# EAGLE schematic DataloggerE7 (EAGLE 9.3.1)

## Sheet 1 of 4
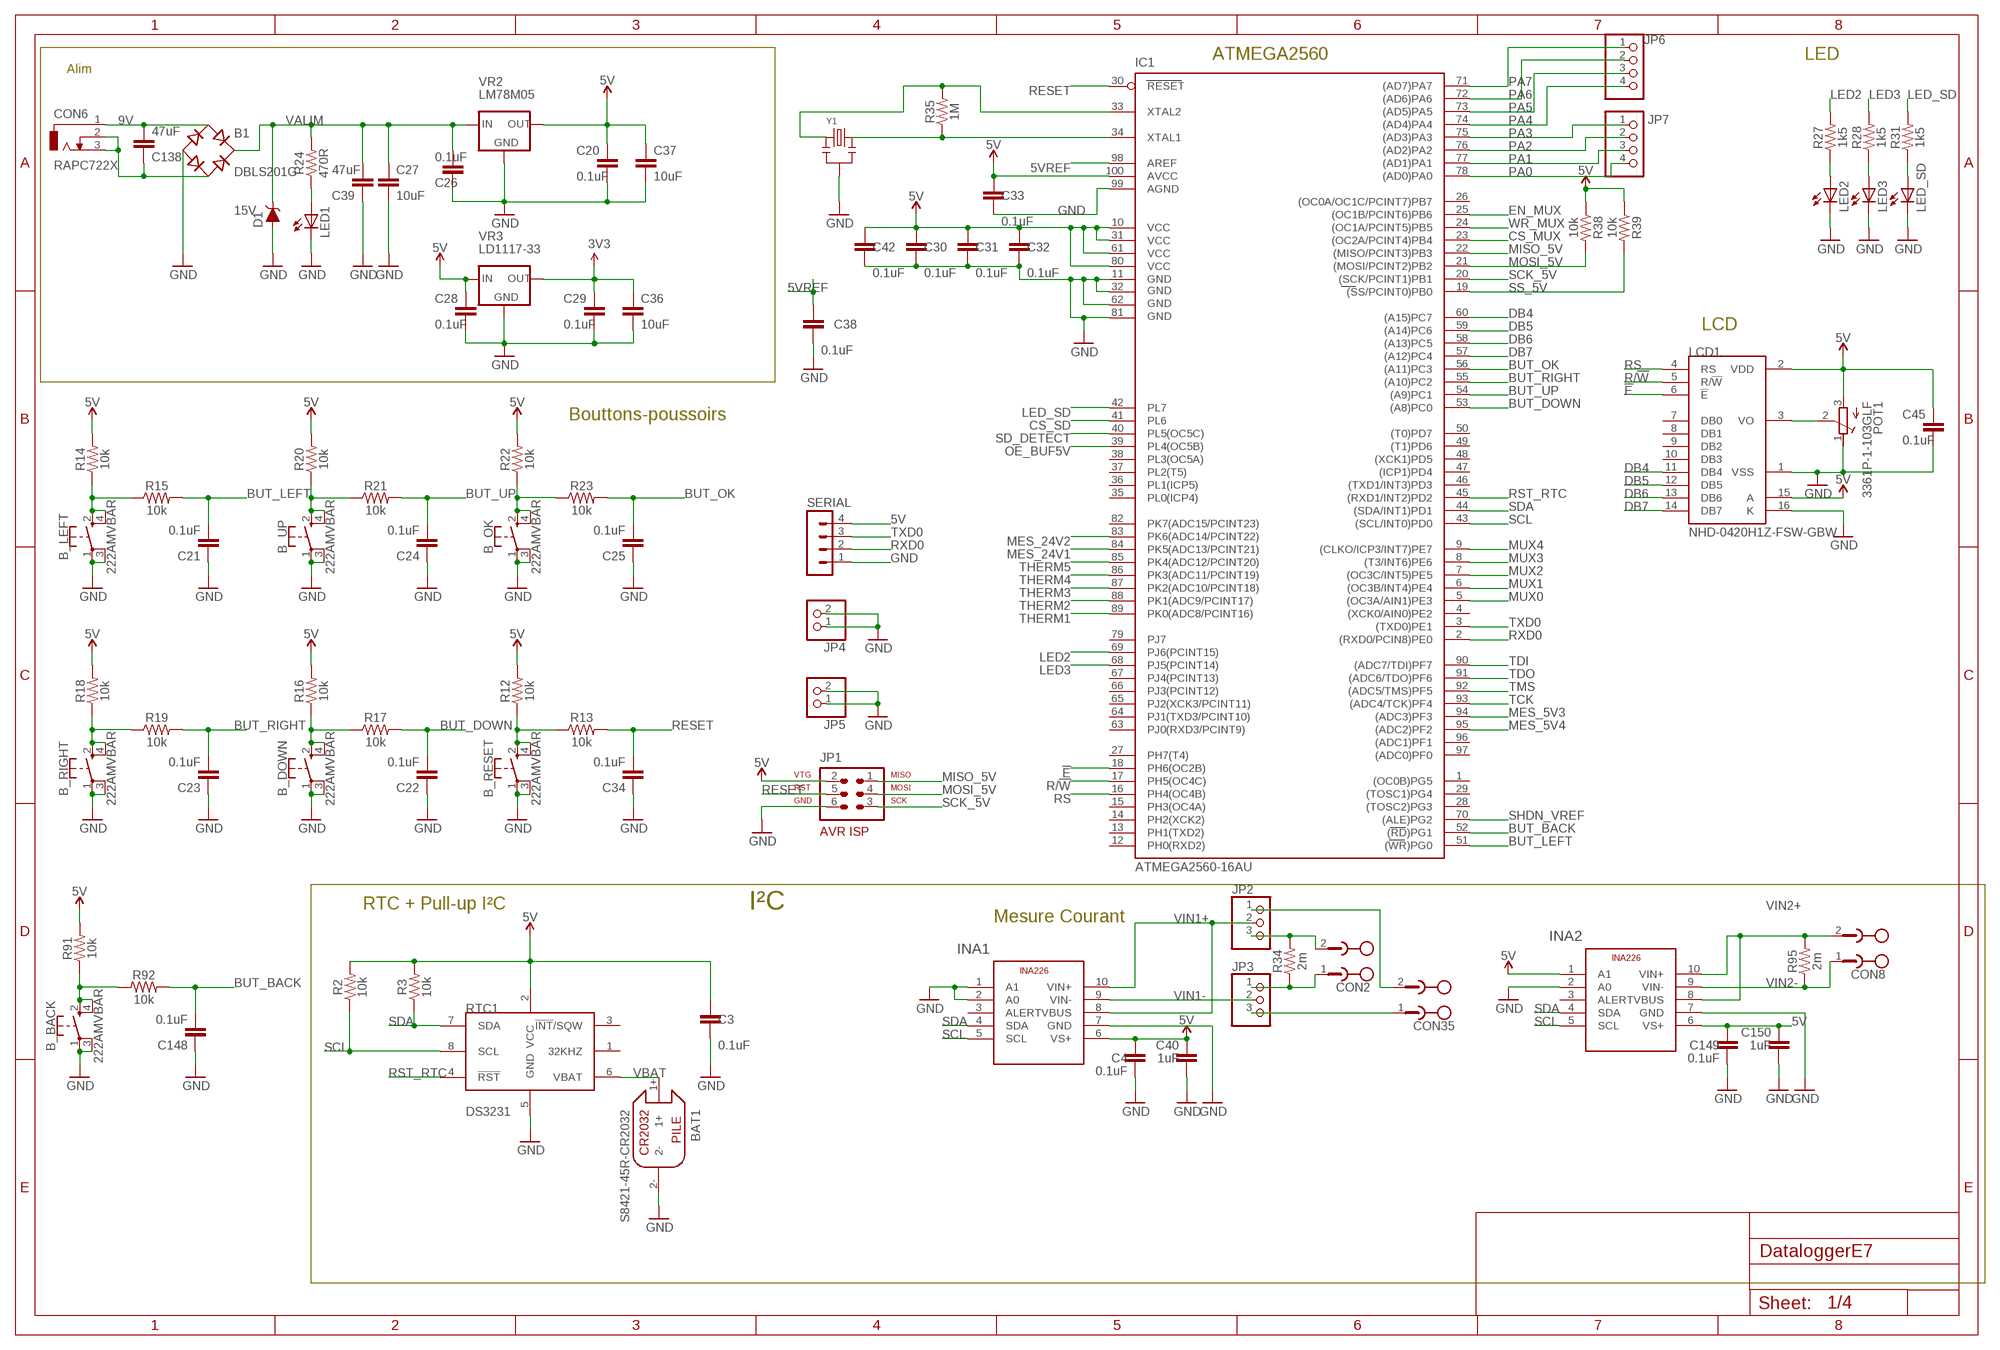
[diagram p0: schematic, sheet 1]

### Parts
B1  DBLS201G  [DBS]
B_BACK  222AMVBAR  [222AMVBARSWITCH]
B_DOWN  222AMVBAR  [222AMVBARSWITCH]
B_LEFT  222AMVBAR  [222AMVBARSWITCH]
B_OK  222AMVBAR  [222AMVBARSWITCH]
B_RESET  222AMVBAR  [222AMVBARSWITCH]
B_RIGHT  222AMVBAR  [222AMVBARSWITCH]
B_UP  222AMVBAR  [222AMVBARSWITCH]
BAT1  S8421-45R-CR2032  [S8421-45R-CR2032]
C3  0.1uF  C0603_0.1UF  [0603]
C4  0.1uF  C0603_0.1UF  [0603]
C20  0.1uF  C0603_0.1UF  [0603]
C21  0.1uF  C0603_0.1UF  [0603]
C22  0.1uF  C0603_0.1UF  [0603]
C23  0.1uF  C0603_0.1UF  [0603]
C24  0.1uF  C0603_0.1UF  [0603]
C25  0.1uF  C0603_0.1UF  [0603]
C26  0.1uF  C0603_0.1UF  [0603]
C27  10uF  C1206_10UF  [1206]
C28  0.1uF  C0603_0.1UF  [0603]
C29  0.1uF  C0603_0.1UF  [0603]
C30  0.1uF  C0603_0.1UF  [0603]
C31  0.1uF  C0603_0.1UF  [0603]
C32  0.1uF  C0603_0.1UF  [0603]
C33  0.1uF  C0603_0.1UF  [0603]
C34  0.1uF  C0603_0.1UF  [0603]
C36  10uF  C1206_10UF  [1206]
C37  10uF  C1206_10UF  [1206]
C38  0.1uF  C0603_0.1UF  [0603]
C39  47uF  C1206_47UF  [1206]
C40  1uF  C0603_1UF  [0603]
C42  0.1uF  C0603_0.1UF  [0603]
C45  0.1uF  C0603_0.1UF  [0603]
C138  47uF  C1206_47UF  [1206]
C148  0.1uF  C0603_0.1UF  [0603]
C149  0.1uF  C0603_0.1UF  [0603]
C150  1uF  C0603_1UF  [0603]
CON2  CON_PHOENIX_508_2  [MSTBV2]
CON6  RAPC722X  [JACK_RAPC722X]
CON8  CON_PHOENIX_508_2  [MSTBV2]
CON35  CON_PHOENIX_508_2  [MSTBV2]
D1  DIODE-ZENER-MMSZ5232BS  [SOD-323]
IC1  ATMEGA2560-16AU  [TQFP100]
INA1  TI-INA226  [TI-INA226]
INA2  TI-INA226  [TI-INA226]
JP1  AVR-ISP-6  [AVR-ISP-6]
JP2  PINHD-1X3  [1X03]
JP3  PINHD-1X3  [1X03]
JP4  PINHD-1X2  [1X02]
JP5  PINHD-1X2  [1X02]
JP6  PINHD-1X4  [1X04]
JP7  PINHD-1X4  [1X04]
LCD1  NHD-0420H1Z-FSW-GBW  [LCD_2X8PINS]
LED1  LEDSMT1206  [1206]
LED2  LEDSMT1206  [1206]
LED3  LEDSMT1206  [1206]
LED_SD  LEDSMT1206  [1206]
POT1  3361P-1-103GLF  [TRIMMER_BOURNS_SMD]
R2  10k  R0603_10K  [0603]
R3  10k  R0603_10K  [0603]
R12  10k  R0603_10K  [0603]
R13  10k  R0603_10K  [0603]
R14  10k  R0603_10K  [0603]
R15  10k  R0603_10K  [0603]
R16  10k  R0603_10K  [0603]
R17  10k  R0603_10K  [0603]
R18  10k  R0603_10K  [0603]
R19  10k  R0603_10K  [0603]
R20  10k  R0603_10K  [0603]
R21  10k  R0603_10K  [0603]
R22  10k  R0603_10K  [0603]
R23  10k  R0603_10K  [0603]
R24  470R  R1206_470R  [1206]
R27  1k5  R0603_1K5  [0603]
R28  1k5  R0603_1K5  [0603]
R31  1k5  R0603_1K5  [0603]
R34  2m  R2010_PRE  [R2010]
R35  1M  R0603_1M  [0603]
R38  10k  R0603_10K  [0603]
R39  10k  R0603_10K  [0603]
R91  10k  R0603_10K  [0603]
R92  10k  R0603_10K  [0603]
R95  2m  R2010_PRE  [R2010]
RTC1  DS3231M  [SOIC8]
SERIAL  MA04-1  [MA04-1]
VR2  LM78M05  [TO-252]
VR3  LD1117-33  [SOT223-THERMAL]
Y1  CSTCE16M0V53-R0  [CSTCE_V]

### Nets
3V3: C29.1 C36.1 VR3.2(OUT) VR3.4(OUT) ; also sheet 2,3,4
5V: C3.1 C4.2 C20.1 C28.1 C30.1 C31.1 C32.1 C33.1 C37.1 C40.2 C42.1 C45.1 C149.2 C150.2 IC1.10(VCC) IC1.31(VCC1) IC1.61(VCC2) IC1.80(VCC3) IC1.100(AVCC) INA1.6(VS+) INA2.1(A1) INA2.6(VS+) JP1.2 LCD1.2(VDD) LCD1.15(A) POT1.3(A) R2.2 R3.2 R12.2 R14.2 R16.2 R18.2 R20.2 R22.2 R38.1 R39.1 R91.2 RTC1.2(VCC) SERIAL.4 VR2.2(OUT) VR3.3(IN) ; also sheet 2
5VREF: C38.1 IC1.98(AREF) ; also sheet 2
9V: B1.AC1 C138.1 CON6.1
!E!: IC1.18(PH6(OC2B)) LCD1.6(!E)
BUT_BACK: C148.2 IC1.52((RD)PG1) R92.2
BUT_DOWN: C22.2 IC1.53((A8)PC0) R17.2
BUT_LEFT: C21.2 IC1.51((WR)PG0) R15.2
BUT_OK: C25.2 IC1.56((A11)PC3) R23.2
BUT_RIGHT: C23.2 IC1.55((A10)PC2) R19.2
BUT_UP: C24.2 IC1.54((A9)PC1) R21.2
CS_MUX: IC1.23((OC2A/PCINT4)PB4) ; also sheet 2
CS_SD: IC1.41(PL6) ; also sheet 2
DB4: IC1.60((A15)PC7) LCD1.11(DB4)
DB5: IC1.59((A14)PC6) LCD1.12(DB5)
DB6: IC1.58((A13)PC5) LCD1.13(DB6)
DB7: IC1.57((A12)PC4) LCD1.14(DB7)
EN_MUX: IC1.25((OC1B/PCINT6)PB6) ; also sheet 2
GND: B1.- B_BACK.1 B_BACK.3 B_DOWN.1 B_DOWN.3 B_LEFT.1 B_LEFT.3 B_OK.1 B_OK.3 B_RESET.1 B_RESET.3 B_RIGHT.1 B_RIGHT.3 B_UP.1 B_UP.3 BAT1.2- C3.2 C4.1 C20.2 C21.1 C22.1 C23.1 C24.1 C25.1 C26.2 C27.2 C28.2 C29.2 C30.2 C31.2 C32.2 C33.2 C34.1 C36.2 C37.2 C38.2 C39.2 C40.1 C42.2 C45.2 C148.1 C149.1 C150.1 D1.A IC1.11(GND) IC1.32(GND1) IC1.62(GND2) IC1.81(GND3) IC1.99(AGND) INA1.1(A1) INA1.2(A0) INA1.7(GND) INA2.2(A0) INA2.7(GND) JP1.6 JP4.1 JP4.2 JP5.1 JP5.2 LCD1.1(VSS) LCD1.16(K) LED1.C LED2.C LED3.C LED_SD.C POT1.1(E) RTC1.5(GND) SERIAL.1 VR2.3(GND) VR3.1(GND) Y1.2(GND) ; also sheet 2,3,4
LED2: IC1.69(PJ6(PCINT15)) R27.2
LED3: IC1.68(PJ5(PCINT14)) R28.2
LED_SD: IC1.42(PL7) R31.2
MES_5V3: IC1.94((ADC3)PF3) ; also sheet 2
MES_5V4: IC1.95((ADC2)PF2) ; also sheet 2
MES_24V1: IC1.84(PK5(ADC13/PCINT21)) ; also sheet 2
MES_24V2: IC1.83(PK6(ADC14/PCINT22)) ; also sheet 2
MISO_5V: IC1.22((MISO/PCINT3)PB3) JP1.1 ; also sheet 2
MOSI_5V: IC1.21((MOSI/PCINT2)PB2) JP1.4 R38.2 ; also sheet 2
MUX0: IC1.5((OC3A/AIN1)PE3) ; also sheet 2
MUX1: IC1.6((OC3B/INT4)PE4) ; also sheet 2
MUX2: IC1.7((OC3C/INT5)PE5) ; also sheet 2
MUX3: IC1.8((T3/INT6)PE6) ; also sheet 2
MUX4: IC1.9((CLKO/ICP3/INT7)PE7) ; also sheet 2
N$9: B1.AC2 C138.2 CON6.2 CON6.3
N$11: B_LEFT.2 B_LEFT.4 R14.1 R15.1
N$12: B_DOWN.2 B_DOWN.4 R16.1 R17.1
N$13: B_RIGHT.2 B_RIGHT.4 R18.1 R19.1
N$14: B_UP.2 B_UP.4 R20.1 R21.1
N$15: B_OK.2 B_OK.4 R22.1 R23.1
N$17: B_RESET.2 B_RESET.4 R12.1 R13.1
N$18: LED1.A R24.1
N$20: LCD1.3(VO) POT1.2(S)
N$22: LED_SD.A R31.1
N$26: LED2.A R27.1
N$27: CON2.1 JP3.1 R34.1
N$28: CON2.2 JP2.3 R34.2
N$29: CON35.2 JP2.1
N$30: CON35.1 JP3.3
N$32: LED3.A R28.1
N$51: B_BACK.2 B_BACK.4 R91.1 R92.1
OE_BUF5V: IC1.39(PL4(OC5B)) ; also sheet 2
PA0: IC1.78((AD0)PA0) JP7.4
PA1: IC1.77((AD1)PA1) JP7.3
PA2: IC1.76((AD2)PA2) JP7.2
PA3: IC1.75((AD3)PA3) JP7.1
PA4: IC1.74((AD4)PA4) JP6.4
PA5: IC1.73((AD5)PA5) JP6.3
PA6: IC1.72((AD6)PA6) JP6.2
PA7: IC1.71((AD7)PA7) JP6.1
R/!W!: IC1.17(PH5(OC4C)) LCD1.5(R/!W)
RESET: C34.2 IC1.30(RESET) JP1.5 R13.2 ; also sheet 2
RS: IC1.16(PH4(OC4B)) LCD1.4(RS)
RST_RTC: IC1.45((RXD1/INT2)PD2) RTC1.4(!RST!)
RXD0: IC1.2((RXD0/PCIN8)PE0) SERIAL.2
SCK_5V: IC1.20((SCK/PCINT1)PB1) JP1.3 ; also sheet 2
SCL: IC1.43((SCL/INT0)PD0) INA1.5(SCL) INA2.5(SCL) R2.1 RTC1.8(SCL)
SD_DETECT: IC1.40(PL5(OC5C)) ; also sheet 2
SDA: IC1.44((SDA/INT1)PD1) INA1.4(SDA) INA2.4(SDA) R3.1 RTC1.7(SDA)
SHDN_VREF: IC1.70((ALE)PG2) ; also sheet 2
SS_5V: IC1.19((SS/PCINT0)PB0) R39.2 ; also sheet 2
TCK: IC1.93((ADC4/TCK)PF4) ; also sheet 2
TDI: IC1.90((ADC7/TDI)PF7) ; also sheet 2
TDO: IC1.91((ADC6/TDO)PF6) ; also sheet 2
THERM1: IC1.89(PK0(ADC8/PCINT16)) ; also sheet 2
THERM2: IC1.88(PK1(ADC9/PCINT17)) ; also sheet 2
THERM3: IC1.87(PK2(ADC10/PCINT18)) ; also sheet 2
THERM4: IC1.86(PK3(ADC11/PCINT19)) ; also sheet 2
THERM5: IC1.85(PK4(ADC12/PCINT20)) ; also sheet 2
TMS: IC1.92((ADC5/TMS)PF5) ; also sheet 2
TXD0: IC1.3((TXD0)PE1) SERIAL.3
VALIM: B1.+ C26.1 C27.1 C39.1 D1.C R24.2 VR2.1(IN) ; also sheet 2
VBAT: BAT1.1+ RTC1.6(VBAT)
VIN1+: INA1.8(VBUS) INA1.10(VIN+) JP2.2
VIN1-: INA1.9(VIN-) JP3.2
VIN2+: CON8.2 INA2.8(VBUS) INA2.10(VIN+) R95.2
VIN2-: CON8.1 INA2.9(VIN-) R95.1
WR_MUX: IC1.24((OC1A/PCINT5)PB5) ; also sheet 2
XTAL1: IC1.34(XTAL1) R35.1 Y1.3
XTAL2: IC1.33(XTAL2) R35.2 Y1.1
Unconnected: IC1.1((OC0B)PG5) IC1.4((XCK0/AIN0)PE2) IC1.12(PH0(RXD2)) IC1.13(PH1(TXD2)) IC1.14(PH2(XCK2)) IC1.15(PH3(OC4A)) IC1.26((OC0A/OC1C/PCINT7)PB7) IC1.27(PH7(T4)) IC1.28((TOSC2)PG3) IC1.29((TOSC1)PG4) IC1.35(PL0(ICP4)) IC1.36(PL1(ICP5)) IC1.37(PL2(T5)) IC1.38(PL3(OC5A)) IC1.46((TXD1/INT3)PD3) IC1.47((ICP1)PD4) IC1.48((XCK1)PD5) IC1.49((T1)PD6) IC1.50((T0)PD7) IC1.63(PJ0(RXD3/PCINT9)) IC1.64(PJ1(TXD3/PCINT10)) IC1.65(PJ2(XCK3/PCINT11)) IC1.66(PJ3(PCINT12)) IC1.67(PJ4(PCINT13)) IC1.79(PJ7) IC1.82(PK7(ADC15/PCINT23)) IC1.96((ADC1)PF1) IC1.97((ADC0)PF0) INA1.3(ALERT) INA2.3(ALERT) LCD1.7(DB0) LCD1.8(DB1) LCD1.9(DB2) LCD1.10(DB3) RTC1.1(32KHZ) RTC1.3(!INT!/SQW)

### Notes on the sheet
- ATMEGA2560 | LED
- Alim
- 15V
- LCD
- Bouttons-poussoirs
- RTC + Pull-up I²C | I²C
- Mesure Courant

## Sheet 2 of 4
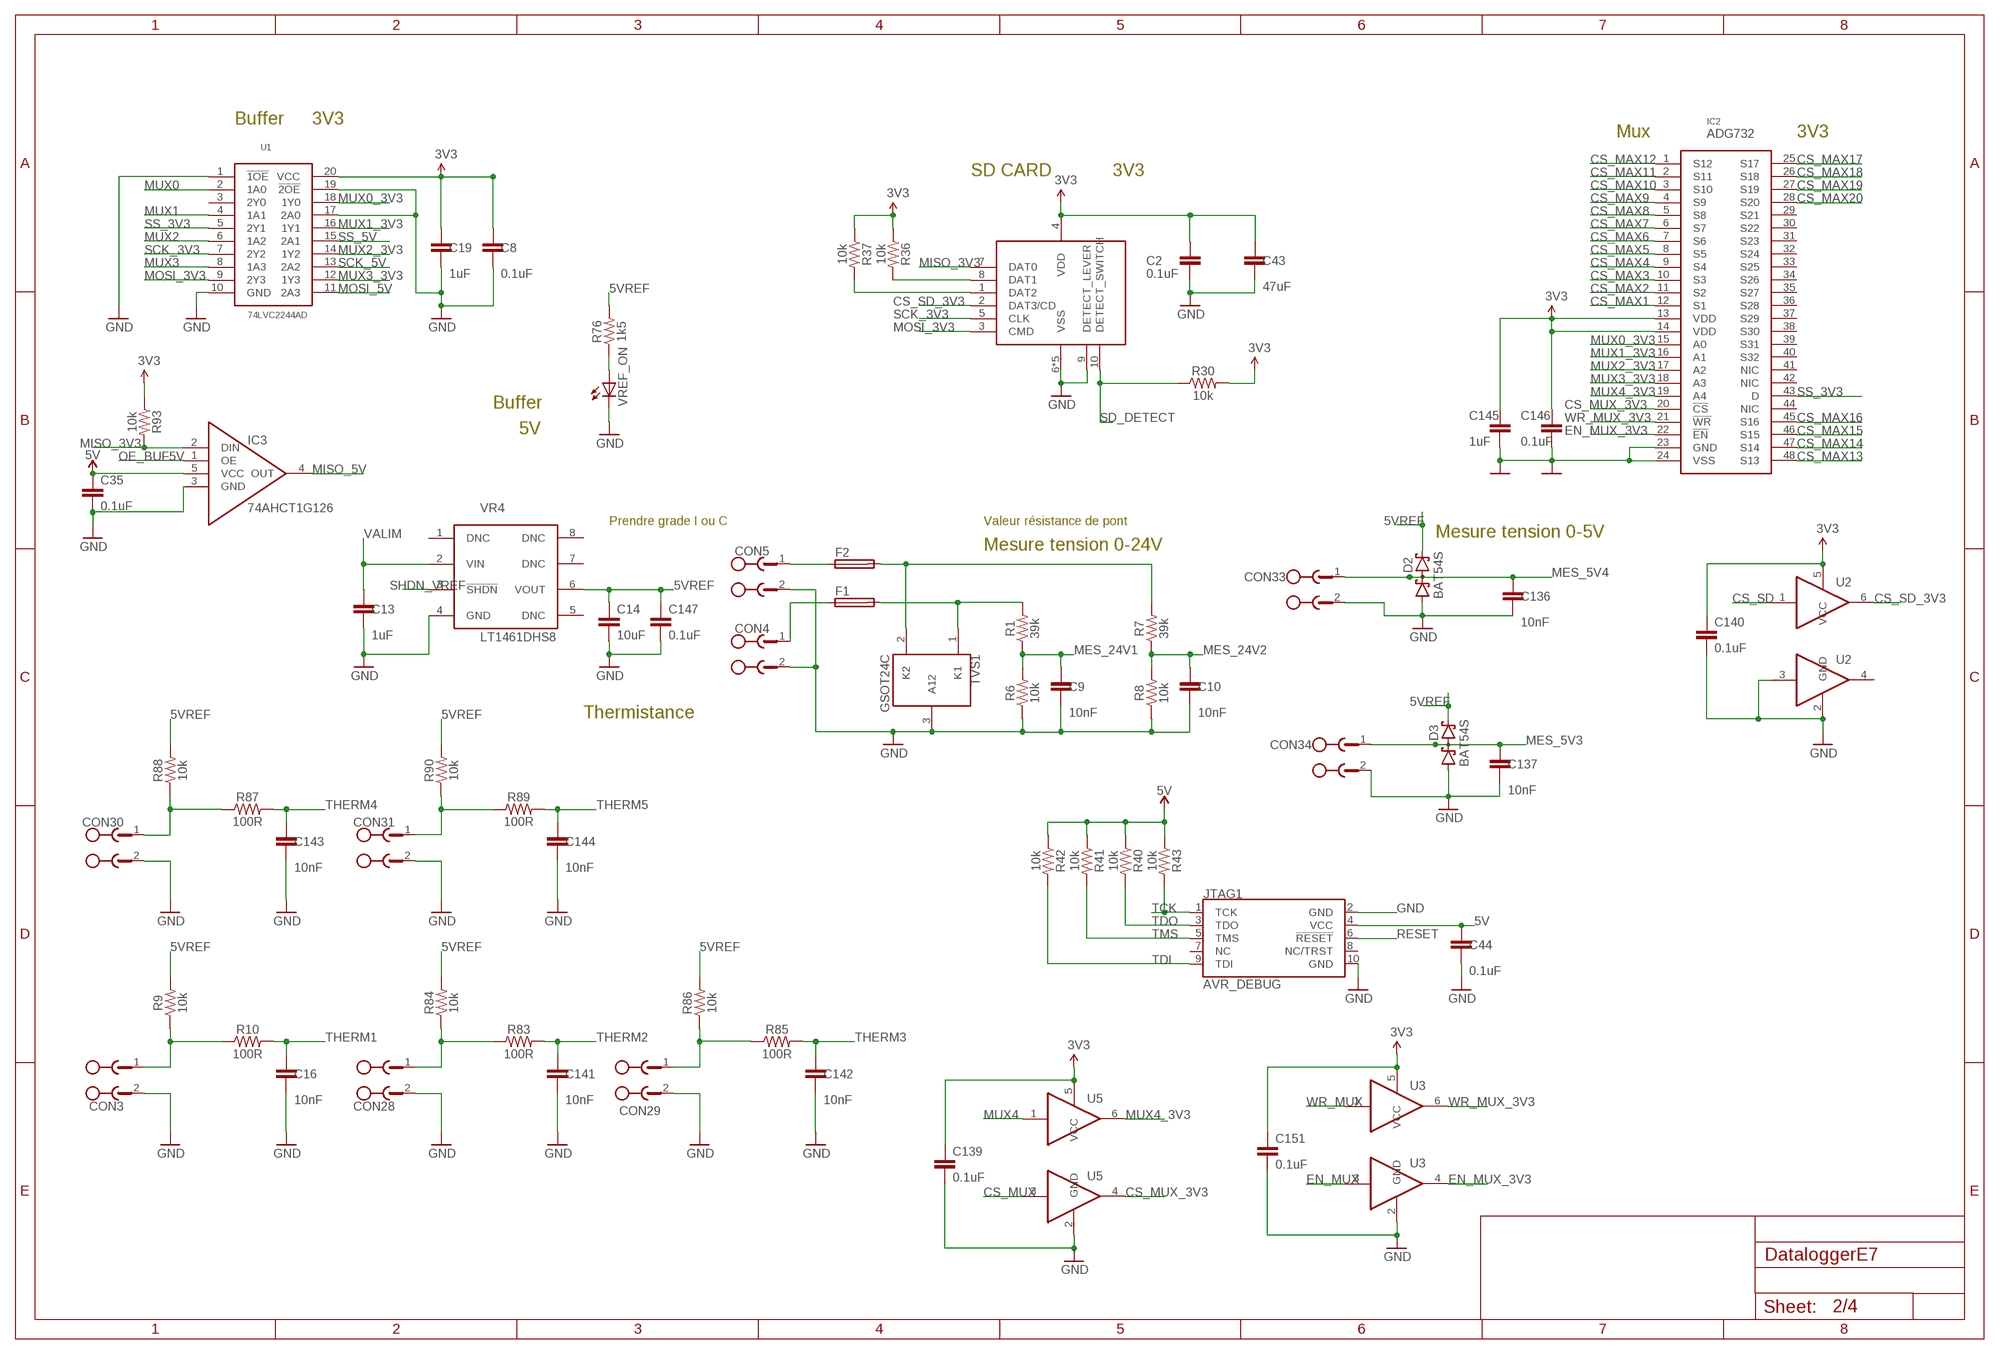
[diagram p1: schematic, sheet 2]

### Parts
C2  0.1uF  C0603_0.1UF  [0603]
C8  0.1uF  C0603_0.1UF  [0603]
C9  10nF  C0603_10NF  [0603]
C10  10nF  C0603_10NF  [0603]
C13  1uF  C0603_1UF  [0603]
C14  10uF  C1206_10UF  [1206]
C16  10nF  C0603_10NF  [0603]
C19  1uF  C0603_1UF  [0603]
C35  0.1uF  C0603_0.1UF  [0603]
C43  47uF  C1206_47UF  [1206]
C44  0.1uF  C0603_0.1UF  [0603]
C136  10nF  C0603_10NF  [0603]
C137  10nF  C0603_10NF  [0603]
C139  0.1uF  C0603_0.1UF  [0603]
C140  0.1uF  C0603_0.1UF  [0603]
C141  10nF  C0603_10NF  [0603]
C142  10nF  C0603_10NF  [0603]
C143  10nF  C0603_10NF  [0603]
C144  10nF  C0603_10NF  [0603]
C145  1uF  C0603_1UF  [0603]
C146  0.1uF  C0603_0.1UF  [0603]
C147  0.1uF  C0603_0.1UF  [0603]
C151  0.1uF  C0603_0.1UF  [0603]
CON3  CON_PHOENIX_508_2  [MSTBV2]
CON4  CON_PHOENIX_508_2  [MSTBV2]
CON5  CON_PHOENIX_508_2  [MSTBV2]
CON7  MOLEX_5033981892  [CONNECTOR_SDCARD_5033981892]
CON28  CON_PHOENIX_508_2  [MSTBV2]
CON29  CON_PHOENIX_508_2  [MSTBV2]
CON30  CON_PHOENIX_508_2  [MSTBV2]
CON31  CON_PHOENIX_508_2  [MSTBV2]
CON33  CON_PHOENIX_508_2  [MSTBV2]
CON34  CON_PHOENIX_508_2  [MSTBV2]
D2  BAT54S  [SOT23]
D3  BAT54S  [SOT23]
F1  0ZCJ0005FF2E  [0ZCJ_SERIES]
F2  0ZCJ0005FF2E  [0ZCJ_SERIES]
IC2  ADG732  ADG732TQFP48  [QFP50P900X900X105-48]
IC3  74AHCT1G126  [SOT353]
JTAG1  AVR_DEBUG  [2X5-PTH-1.27MM]
R1  39k  R0603_39K  [0603]
R6  10k  R0603_10K  [0603]
R7  39k  R0603_39K  [0603]
R8  10k  R0603_10K  [0603]
R9  10k  R0603_10K  [0603]
R10  100R  R0603_100R  [0603]
R30  10k  R0603_10K  [0603]
R36  10k  R0603_10K  [0603]
R37  10k  R0603_10K  [0603]
R40  10k  R0603_10K  [0603]
R41  10k  R0603_10K  [0603]
R42  10k  R0603_10K  [0603]
R43  10k  R0603_10K  [0603]
R76  1k5  R0603_1K5  [0603]
R83  100R  R0603_100R  [0603]
R84  10k  R0603_10K  [0603]
R85  100R  R0603_100R  [0603]
R86  10k  R0603_10K  [0603]
R87  100R  R0603_100R  [0603]
R88  10k  R0603_10K  [0603]
R89  100R  R0603_100R  [0603]
R90  10k  R0603_10K  [0603]
R93  10k  R0603_10K  [0603]
TVS1  GSOT24C  [SOT23_3PAD]
U1  74LVC2244AD  [SOIC20]
U2  74LVC2G17SOT363  [SOT363]
U3  74LVC2G17SOT363  [SOT363]
U5  74LVC2G17SOT363  [SOT363]
VR4  LT1461DHS8  [SOIC8-LT1461]
VREF_ON  LEDSMT1206  [1206]

### Nets
3V3: C2.1 C8.1 C19.1 C43.1 C139.1 C140.1 C145.1 C146.1 C151.1 CON7.4(VDD) IC2.13(VDD) IC2.14(VDD) R30.2 R36.1 R37.1 R93.1 U1.20(VCC) U2.5(VCC) U3.5(VCC) U5.5(VCC) ; also sheet 1,3,4
5V: C35.1 C44.1 IC3.5(VCC) JTAG1.4(VCC) R40.1 R41.1 R42.1 R43.1 ; also sheet 1
5VREF: C14.1 C147.1 D2.2(C2) D3.2(C2) R9.2 R76.2 R84.2 R86.2 R88.2 R90.2 VR4.6(VOUT) ; also sheet 1
CS_MAX1: IC2.12(S1) ; also sheet 3
CS_MAX2: IC2.11(S2) ; also sheet 3
CS_MAX3: IC2.10(S3) ; also sheet 3
CS_MAX4: IC2.9(S4) ; also sheet 3
CS_MAX5: IC2.8(S5) ; also sheet 3
CS_MAX6: IC2.7(S6) ; also sheet 3
CS_MAX7: IC2.6(S7) ; also sheet 3
CS_MAX8: IC2.5(S8) ; also sheet 3
CS_MAX9: IC2.4(S9) ; also sheet 3
CS_MAX10: IC2.3(S10) ; also sheet 3
CS_MAX11: IC2.2(S11) ; also sheet 3
CS_MAX12: IC2.1(S12) ; also sheet 4
CS_MAX13: IC2.48(S13) ; also sheet 4
CS_MAX14: IC2.47(S14) ; also sheet 4
CS_MAX15: IC2.46(S15) ; also sheet 4
CS_MAX16: IC2.45(S16) ; also sheet 4
CS_MAX17: IC2.25(S17) ; also sheet 4
CS_MAX18: IC2.26(S18) ; also sheet 4
CS_MAX19: IC2.27(S19) ; also sheet 4
CS_MAX20: IC2.28(S20) ; also sheet 4
CS_MUX: U5.3(I1) ; also sheet 1
CS_MUX_3V3: IC2.20(!CS) U5.4(O1)
CS_SD: U2.1(I) ; also sheet 1
CS_SD_3V3: CON7.2(DAT3/CD) U2.6(O)
EN_MUX: U3.3(I1) ; also sheet 1
EN_MUX_3V3: IC2.22(!EN) U3.4(O1)
GND: C2.2 C8.2 C9.2 C10.2 C13.2 C14.2 C16.2 C19.2 C35.2 C43.2 C44.2 C136.2 C137.2 C139.2 C140.2 C141.2 C142.2 C143.2 C144.2 C145.2 C146.2 C147.2 C151.2 CON3.2 CON4.2 CON5.2 CON7.6(VSS) CON7.9(DETECT_LEVER) CON7.11(VSS) CON7.12(VSS) CON7.13(VSS) CON7.14(VSS) CON28.2 CON29.2 CON30.2 CON31.2 CON33.2 CON34.2 D2.1(A1) D3.1(A1) IC2.23(GND) IC2.24(VSS) IC3.3(GND) JTAG1.2(GND) JTAG1.10(GND) R6.1 R8.1 TVS1.3(A12) U1.1(!1OE!) U1.10(GND) U1.17(2A0) U1.19(!2OE!) U2.2(GND) U2.3(I1) U3.2(GND) U5.2(GND) VR4.4(GND) VREF_ON.C ; also sheet 1,3,4
MES_5V3: C137.1 CON34.1 D3.3(C1A2) ; also sheet 1
MES_5V4: C136.1 CON33.1 D2.3(C1A2) ; also sheet 1
MES_24V1: C9.1 R1.1 R6.2 ; also sheet 1
MES_24V2: C10.1 R7.1 R8.2 ; also sheet 1
MISO_3V3: CON7.7(DAT0) IC3.2(DIN) R93.2 ; also sheet 3,4
MISO_5V: IC3.4(OUT) ; also sheet 1
MOSI_3V3: CON7.3(CMD) U1.9(2Y3) ; also sheet 3,4
MOSI_5V: U1.11(2A3) ; also sheet 1
MUX0: U1.2(1A0) ; also sheet 1
MUX0_3V3: IC2.15(A0) U1.18(1Y0)
MUX1: U1.4(1A1) ; also sheet 1
MUX1_3V3: IC2.16(A1) U1.16(1Y1)
MUX2: U1.6(1A2) ; also sheet 1
MUX2_3V3: IC2.17(A2) U1.14(1Y2)
MUX3: U1.8(1A3) ; also sheet 1
MUX3_3V3: IC2.18(A3) U1.12(1Y3)
MUX4: U5.1(I) ; also sheet 1
MUX4_3V3: IC2.19(A4) U5.6(O)
N$1: F2.2 R7.2 TVS1.2(K2)
N$3: CON7.8(DAT1) R36.2
N$4: CON7.1(DAT2) R37.2
N$6: CON3.1 R9.1 R10.1
N$8: F1.2 R1.2 TVS1.1(K1)
N$19: CON5.1 F2.1
N$21: CON30.1 R87.1 R88.1
N$23: CON29.1 R85.1 R86.1
N$24: CON4.1 F1.1
N$47: CON28.1 R83.1 R84.1
N$48: R76.1 VREF_ON.A
N$50: CON31.1 R89.1 R90.1
OE_BUF5V: IC3.1(OE) ; also sheet 1
RESET: JTAG1.6(!RESET!) ; also sheet 1
SCK_3V3: CON7.5(CLK) U1.7(2Y2) ; also sheet 3,4
SCK_5V: U1.13(2A2) ; also sheet 1
SD_DETECT: CON7.10(DETECT_SWITCH) R30.1 ; also sheet 1
SHDN_VREF: VR4.3(!SHDN!) ; also sheet 1
SS_3V3: IC2.43(D) U1.5(2Y1)
SS_5V: U1.15(2A1) ; also sheet 1
TCK: JTAG1.1(TCK) R43.2 ; also sheet 1
TDI: JTAG1.9(TDI) R42.2 ; also sheet 1
TDO: JTAG1.3(TDO) R40.2 ; also sheet 1
THERM1: C16.1 R10.2 ; also sheet 1
THERM2: C141.1 R83.2 ; also sheet 1
THERM3: C142.1 R85.2 ; also sheet 1
THERM4: C143.1 R87.2 ; also sheet 1
THERM5: C144.1 R89.2 ; also sheet 1
TMS: JTAG1.5(TMS) R41.2 ; also sheet 1
VALIM: C13.1 VR4.2(VIN) ; also sheet 1
WR_MUX: U3.1(I) ; also sheet 1
WR_MUX_3V3: IC2.21(!WR) U3.6(O)
Unconnected: IC2.29(S21) IC2.30(S22) IC2.31(S23) IC2.32(S24) IC2.33(S25) IC2.34(S26) IC2.35(S27) IC2.36(S28) IC2.37(S29) IC2.38(S30) IC2.39(S31) IC2.40(S32) IC2.41(NIC) IC2.42(NIC) IC2.44(NIC) JTAG1.7(NC) JTAG1.8(NC/TRST) U1.3(2Y0) U2.4(O1) VR4.1(DNC) VR4.5(DNC) VR4.7(DNC) VR4.8(DNC)

### Notes on the sheet
- Buffer | 3V3
- Mux | 3V3
- SD CARD | 3V3
- Buffer
- 5V
- Prendre grade I ou C | Valeur résistance de pont
- Mesure tension 0-5V
- Mesure tension 0-24V
- Thermistance

## Sheet 3 of 4
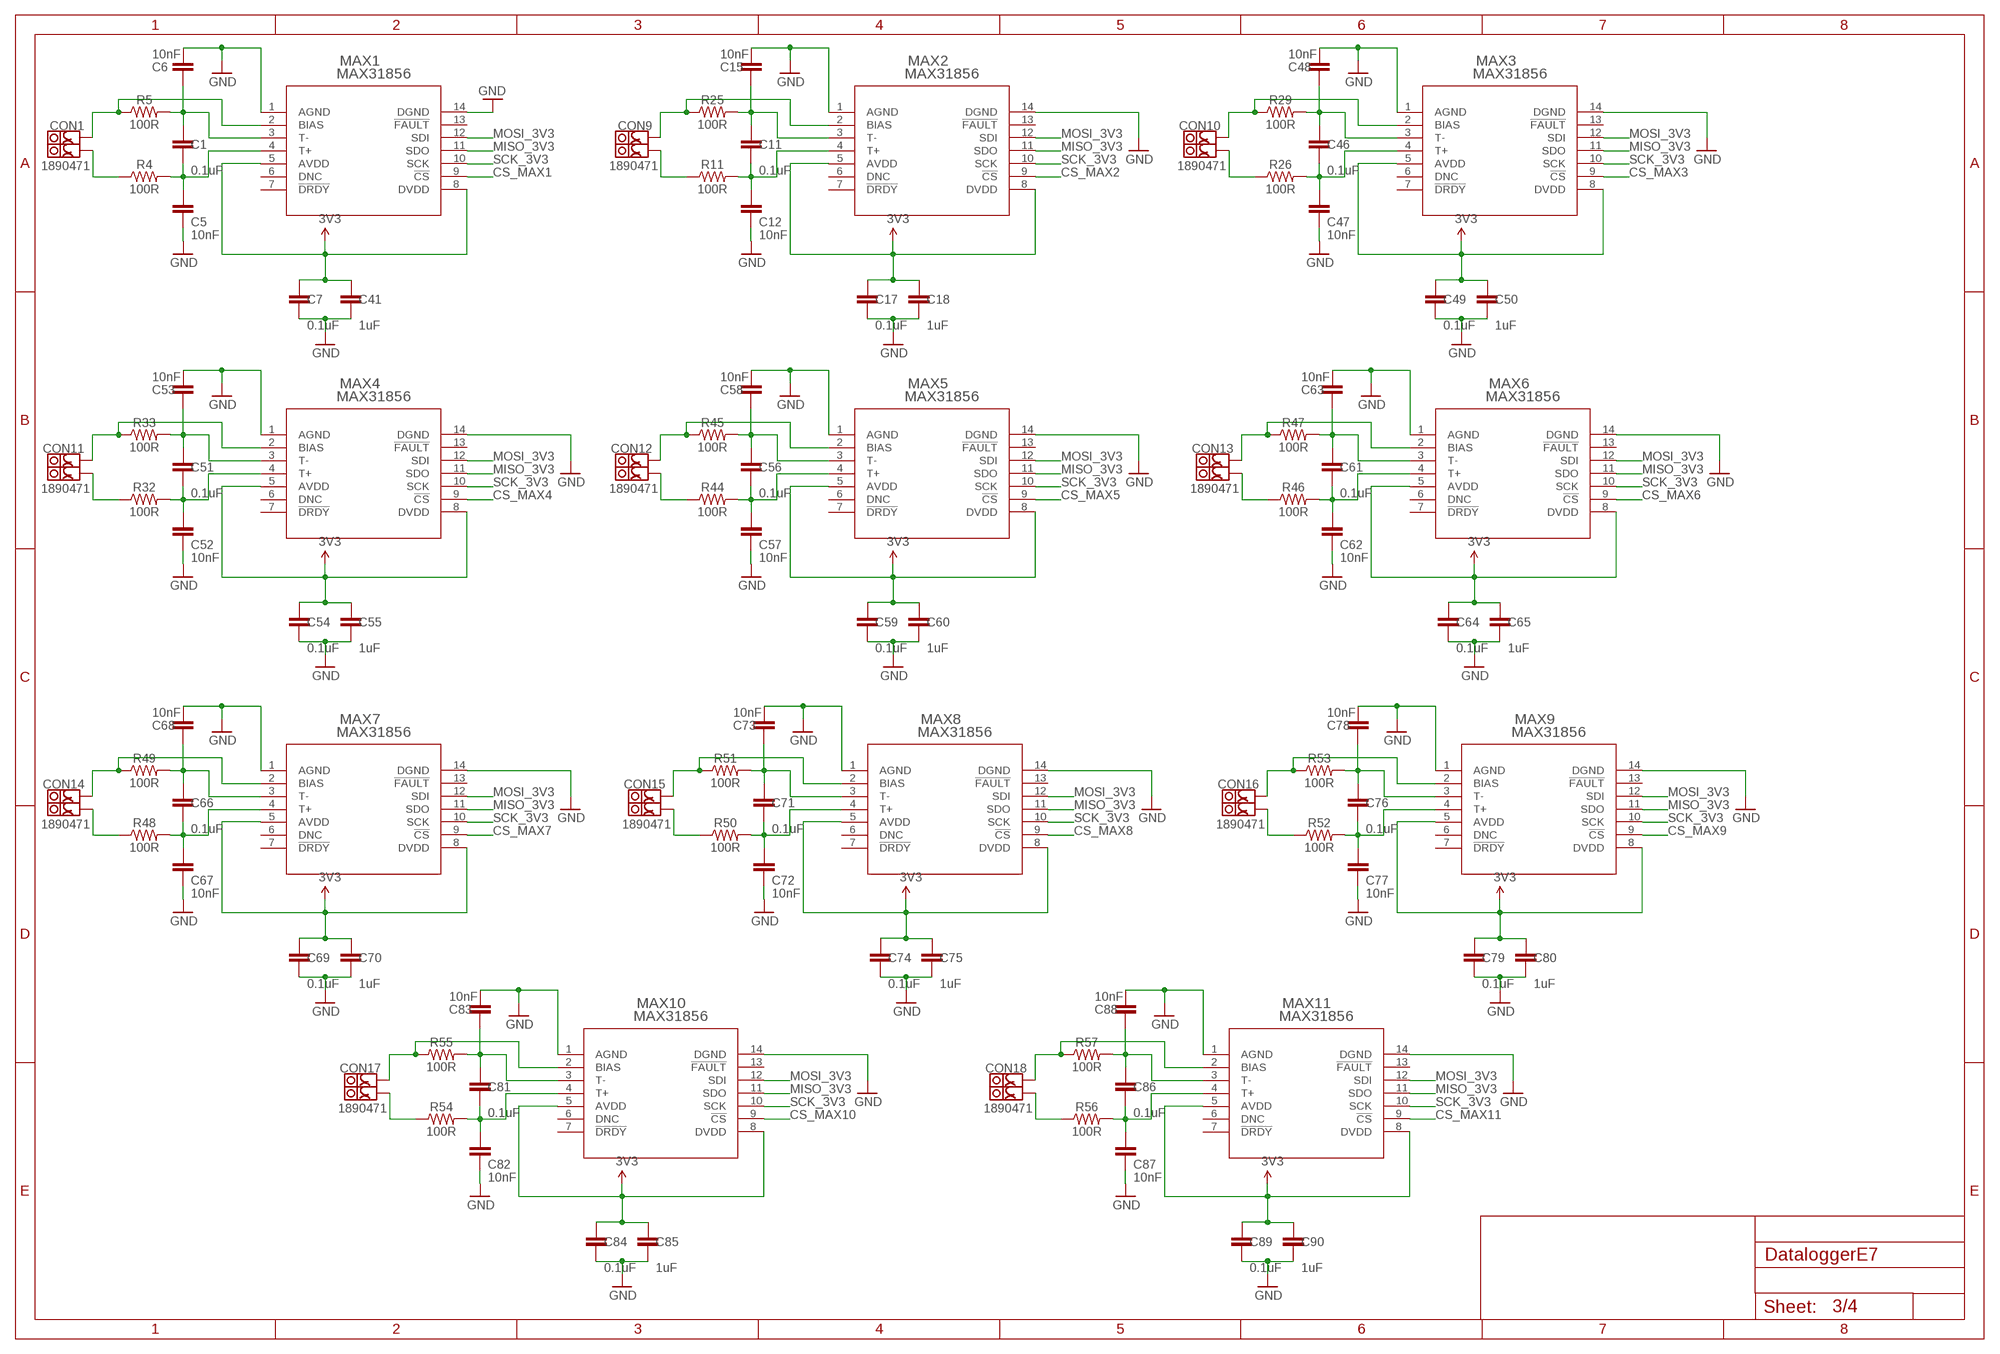
[diagram p2: schematic, sheet 3]

### Parts
C1  0.1uF  C0603_0.1UF  [0603]
C5  10nF  C0603_10NF  [0603]
C6  10nF  C0603_10NF  [0603]
C7  0.1uF  C0603_0.1UF  [0603]
C11  0.1uF  C0603_0.1UF  [0603]
C12  10nF  C0603_10NF  [0603]
C15  10nF  C0603_10NF  [0603]
C17  0.1uF  C0603_0.1UF  [0603]
C18  1uF  C0603_1UF  [0603]
C41  1uF  C0603_1UF  [0603]
C46  0.1uF  C0603_0.1UF  [0603]
C47  10nF  C0603_10NF  [0603]
C48  10nF  C0603_10NF  [0603]
C49  0.1uF  C0603_0.1UF  [0603]
C50  1uF  C0603_1UF  [0603]
C51  0.1uF  C0603_0.1UF  [0603]
C52  10nF  C0603_10NF  [0603]
C53  10nF  C0603_10NF  [0603]
C54  0.1uF  C0603_0.1UF  [0603]
C55  1uF  C0603_1UF  [0603]
C56  0.1uF  C0603_0.1UF  [0603]
C57  10nF  C0603_10NF  [0603]
C58  10nF  C0603_10NF  [0603]
C59  0.1uF  C0603_0.1UF  [0603]
C60  1uF  C0603_1UF  [0603]
C61  0.1uF  C0603_0.1UF  [0603]
C62  10nF  C0603_10NF  [0603]
C63  10nF  C0603_10NF  [0603]
C64  0.1uF  C0603_0.1UF  [0603]
C65  1uF  C0603_1UF  [0603]
C66  0.1uF  C0603_0.1UF  [0603]
C67  10nF  C0603_10NF  [0603]
C68  10nF  C0603_10NF  [0603]
C69  0.1uF  C0603_0.1UF  [0603]
C70  1uF  C0603_1UF  [0603]
C71  0.1uF  C0603_0.1UF  [0603]
C72  10nF  C0603_10NF  [0603]
C73  10nF  C0603_10NF  [0603]
C74  0.1uF  C0603_0.1UF  [0603]
C75  1uF  C0603_1UF  [0603]
C76  0.1uF  C0603_0.1UF  [0603]
C77  10nF  C0603_10NF  [0603]
C78  10nF  C0603_10NF  [0603]
C79  0.1uF  C0603_0.1UF  [0603]
C80  1uF  C0603_1UF  [0603]
C81  0.1uF  C0603_0.1UF  [0603]
C82  10nF  C0603_10NF  [0603]
C83  10nF  C0603_10NF  [0603]
C84  0.1uF  C0603_0.1UF  [0603]
C85  1uF  C0603_1UF  [0603]
C86  0.1uF  C0603_0.1UF  [0603]
C87  10nF  C0603_10NF  [0603]
C88  10nF  C0603_10NF  [0603]
C89  0.1uF  C0603_0.1UF  [0603]
C90  1uF  C0603_1UF  [0603]
CON1  1890471  [1890471]
CON9  1890471  [1890471]
CON10  1890471  [1890471]
CON11  1890471  [1890471]
CON12  1890471  [1890471]
CON13  1890471  [1890471]
CON14  1890471  [1890471]
CON15  1890471  [1890471]
CON16  1890471  [1890471]
CON17  1890471  [1890471]
CON18  1890471  [1890471]
MAX1  MAX31856  [21-066J-14-M]
MAX2  MAX31856  [21-066J-14-M]
MAX3  MAX31856  [21-066J-14-M]
MAX4  MAX31856  [21-066J-14-M]
MAX5  MAX31856  [21-066J-14-M]
MAX6  MAX31856  [21-066J-14-M]
MAX7  MAX31856  [21-066J-14-M]
MAX8  MAX31856  [21-066J-14-M]
MAX9  MAX31856  [21-066J-14-M]
MAX10  MAX31856  [21-066J-14-M]
MAX11  MAX31856  [21-066J-14-M]
R4  100R  R0603_100R  [0603]
R5  100R  R0603_100R  [0603]
R11  100R  R0603_100R  [0603]
R25  100R  R0603_100R  [0603]
R26  100R  R0603_100R  [0603]
R29  100R  R0603_100R  [0603]
R32  100R  R0603_100R  [0603]
R33  100R  R0603_100R  [0603]
R44  100R  R0603_100R  [0603]
R45  100R  R0603_100R  [0603]
R46  100R  R0603_100R  [0603]
R47  100R  R0603_100R  [0603]
R48  100R  R0603_100R  [0603]
R49  100R  R0603_100R  [0603]
R50  100R  R0603_100R  [0603]
R51  100R  R0603_100R  [0603]
R52  100R  R0603_100R  [0603]
R53  100R  R0603_100R  [0603]
R54  100R  R0603_100R  [0603]
R55  100R  R0603_100R  [0603]
R56  100R  R0603_100R  [0603]
R57  100R  R0603_100R  [0603]

### Nets
3V3: C7.1 C17.1 C18.1 C41.1 C49.1 C50.1 C54.1 C55.1 C59.1 C60.1 C64.1 C65.1 C69.1 C70.1 C74.1 C75.1 C79.1 C80.1 C84.1 C85.1 C89.1 C90.1 MAX1.5(AVDD) MAX1.8(DVDD) MAX2.5(AVDD) MAX2.8(DVDD) MAX3.5(AVDD) MAX3.8(DVDD) MAX4.5(AVDD) MAX4.8(DVDD) MAX5.5(AVDD) MAX5.8(DVDD) MAX6.5(AVDD) MAX6.8(DVDD) MAX7.5(AVDD) MAX7.8(DVDD) MAX8.5(AVDD) MAX8.8(DVDD) MAX9.5(AVDD) MAX9.8(DVDD) MAX10.5(AVDD) MAX10.8(DVDD) MAX11.5(AVDD) MAX11.8(DVDD) ; also sheet 1,2,4
BIAS: CON1.A(1A) CON1.B(1A) MAX1.2(BIAS) R5.1
BIAS1: CON9.A(1A) CON9.B(1A) MAX2.2(BIAS) R25.1
BIAS2: CON10.A(1A) CON10.B(1A) MAX3.2(BIAS) R29.1
BIAS3: CON11.A(1A) CON11.B(1A) MAX4.2(BIAS) R33.1
BIAS5: CON12.A(1A) CON12.B(1A) MAX5.2(BIAS) R45.1
BIAS6: CON13.A(1A) CON13.B(1A) MAX6.2(BIAS) R47.1
BIAS7: CON14.A(1A) CON14.B(1A) MAX7.2(BIAS) R49.1
BIAS8: CON15.A(1A) CON15.B(1A) MAX8.2(BIAS) R51.1
BIAS9: CON16.A(1A) CON16.B(1A) MAX9.2(BIAS) R53.1
BIAS10: CON17.A(1A) CON17.B(1A) MAX10.2(BIAS) R55.1
BIAS11: CON18.A(1A) CON18.B(1A) MAX11.2(BIAS) R57.1
CS_MAX1: MAX1.9(!CS) ; also sheet 2
CS_MAX2: MAX2.9(!CS) ; also sheet 2
CS_MAX3: MAX3.9(!CS) ; also sheet 2
CS_MAX4: MAX4.9(!CS) ; also sheet 2
CS_MAX5: MAX5.9(!CS) ; also sheet 2
CS_MAX6: MAX6.9(!CS) ; also sheet 2
CS_MAX7: MAX7.9(!CS) ; also sheet 2
CS_MAX8: MAX8.9(!CS) ; also sheet 2
CS_MAX9: MAX9.9(!CS) ; also sheet 2
CS_MAX10: MAX10.9(!CS) ; also sheet 2
CS_MAX11: MAX11.9(!CS) ; also sheet 2
GND: C5.2 C6.1 C7.2 C12.2 C15.1 C17.2 C18.2 C41.2 C47.2 C48.1 C49.2 C50.2 C52.2 C53.1 C54.2 C55.2 C57.2 C58.1 C59.2 C60.2 C62.2 C63.1 C64.2 C65.2 C67.2 C68.1 C69.2 C70.2 C72.2 C73.1 C74.2 C75.2 C77.2 C78.1 C79.2 C80.2 C82.2 C83.1 C84.2 C85.2 C87.2 C88.1 C89.2 C90.2 MAX1.1(AGND) MAX1.14(DGND) MAX2.1(AGND) MAX2.14(DGND) MAX3.1(AGND) MAX3.14(DGND) MAX4.1(AGND) MAX4.14(DGND) MAX5.1(AGND) MAX5.14(DGND) MAX6.1(AGND) MAX6.14(DGND) MAX7.1(AGND) MAX7.14(DGND) MAX8.1(AGND) MAX8.14(DGND) MAX9.1(AGND) MAX9.14(DGND) MAX10.1(AGND) MAX10.14(DGND) MAX11.1(AGND) MAX11.14(DGND) ; also sheet 1,2,4
MISO_3V3: MAX1.11(SDO) MAX2.11(SDO) MAX3.11(SDO) MAX4.11(SDO) MAX5.11(SDO) MAX6.11(SDO) MAX7.11(SDO) MAX8.11(SDO) MAX9.11(SDO) MAX10.11(SDO) MAX11.11(SDO) ; also sheet 2,4
MOSI_3V3: MAX1.12(SDI) MAX2.12(SDI) MAX3.12(SDI) MAX4.12(SDI) MAX5.12(SDI) MAX6.12(SDI) MAX7.12(SDI) MAX8.12(SDI) MAX9.12(SDI) MAX10.12(SDI) MAX11.12(SDI) ; also sheet 2,4
N$25: CON1.A1(1A1) CON1.B1(1A1) R4.1
N$31: CON9.A1(1A1) CON9.B1(1A1) R11.1
N$33: CON10.A1(1A1) CON10.B1(1A1) R26.1
N$34: CON11.A1(1A1) CON11.B1(1A1) R32.1
N$35: CON12.A1(1A1) CON12.B1(1A1) R44.1
N$36: CON13.A1(1A1) CON13.B1(1A1) R46.1
N$37: CON14.A1(1A1) CON14.B1(1A1) R48.1
N$38: CON15.A1(1A1) CON15.B1(1A1) R50.1
N$39: CON16.A1(1A1) CON16.B1(1A1) R52.1
N$40: CON17.A1(1A1) CON17.B1(1A1) R54.1
N$41: CON18.A1(1A1) CON18.B1(1A1) R56.1
SCK_3V3: MAX1.10(SCK) MAX2.10(SCK) MAX3.10(SCK) MAX4.10(SCK) MAX5.10(SCK) MAX6.10(SCK) MAX7.10(SCK) MAX8.10(SCK) MAX9.10(SCK) MAX10.10(SCK) MAX11.10(SCK) ; also sheet 2,4
T+: C1.2 C5.1 MAX1.4(T+) R4.2
T+1: C11.2 C12.1 MAX2.4(T+) R11.2
T+2: C46.2 C47.1 MAX3.4(T+) R26.2
T+3: C51.2 C52.1 MAX4.4(T+) R32.2
T+5: C56.2 C57.1 MAX5.4(T+) R44.2
T+6: C61.2 C62.1 MAX6.4(T+) R46.2
T+7: C66.2 C67.1 MAX7.4(T+) R48.2
T+8: C71.2 C72.1 MAX8.4(T+) R50.2
T+9: C76.2 C77.1 MAX9.4(T+) R52.2
T+10: C81.2 C82.1 MAX10.4(T+) R54.2
T+11: C86.2 C87.1 MAX11.4(T+) R56.2
T-: C1.1 C6.2 MAX1.3(T-) R5.2
T-1: C11.1 C15.2 MAX2.3(T-) R25.2
T-2: C46.1 C48.2 MAX3.3(T-) R29.2
T-3: C51.1 C53.2 MAX4.3(T-) R33.2
T-5: C56.1 C58.2 MAX5.3(T-) R45.2
T-6: C61.1 C63.2 MAX6.3(T-) R47.2
T-7: C66.1 C68.2 MAX7.3(T-) R49.2
T-8: C71.1 C73.2 MAX8.3(T-) R51.2
T-9: C76.1 C78.2 MAX9.3(T-) R53.2
T-10: C81.1 C83.2 MAX10.3(T-) R55.2
T-11: C86.1 C88.2 MAX11.3(T-) R57.2
Unconnected: MAX1.6(DNC) MAX1.7(!DRDY) MAX1.13(!FAULT) MAX2.6(DNC) MAX2.7(!DRDY) MAX2.13(!FAULT) MAX3.6(DNC) MAX3.7(!DRDY) MAX3.13(!FAULT) MAX4.6(DNC) MAX4.7(!DRDY) MAX4.13(!FAULT) MAX5.6(DNC) MAX5.7(!DRDY) MAX5.13(!FAULT) MAX6.6(DNC) MAX6.7(!DRDY) MAX6.13(!FAULT) MAX7.6(DNC) MAX7.7(!DRDY) MAX7.13(!FAULT) MAX8.6(DNC) MAX8.7(!DRDY) MAX8.13(!FAULT) MAX9.6(DNC) MAX9.7(!DRDY) MAX9.13(!FAULT) MAX10.6(DNC) MAX10.7(!DRDY) MAX10.13(!FAULT) MAX11.6(DNC) MAX11.7(!DRDY) MAX11.13(!FAULT)

## Sheet 4 of 4
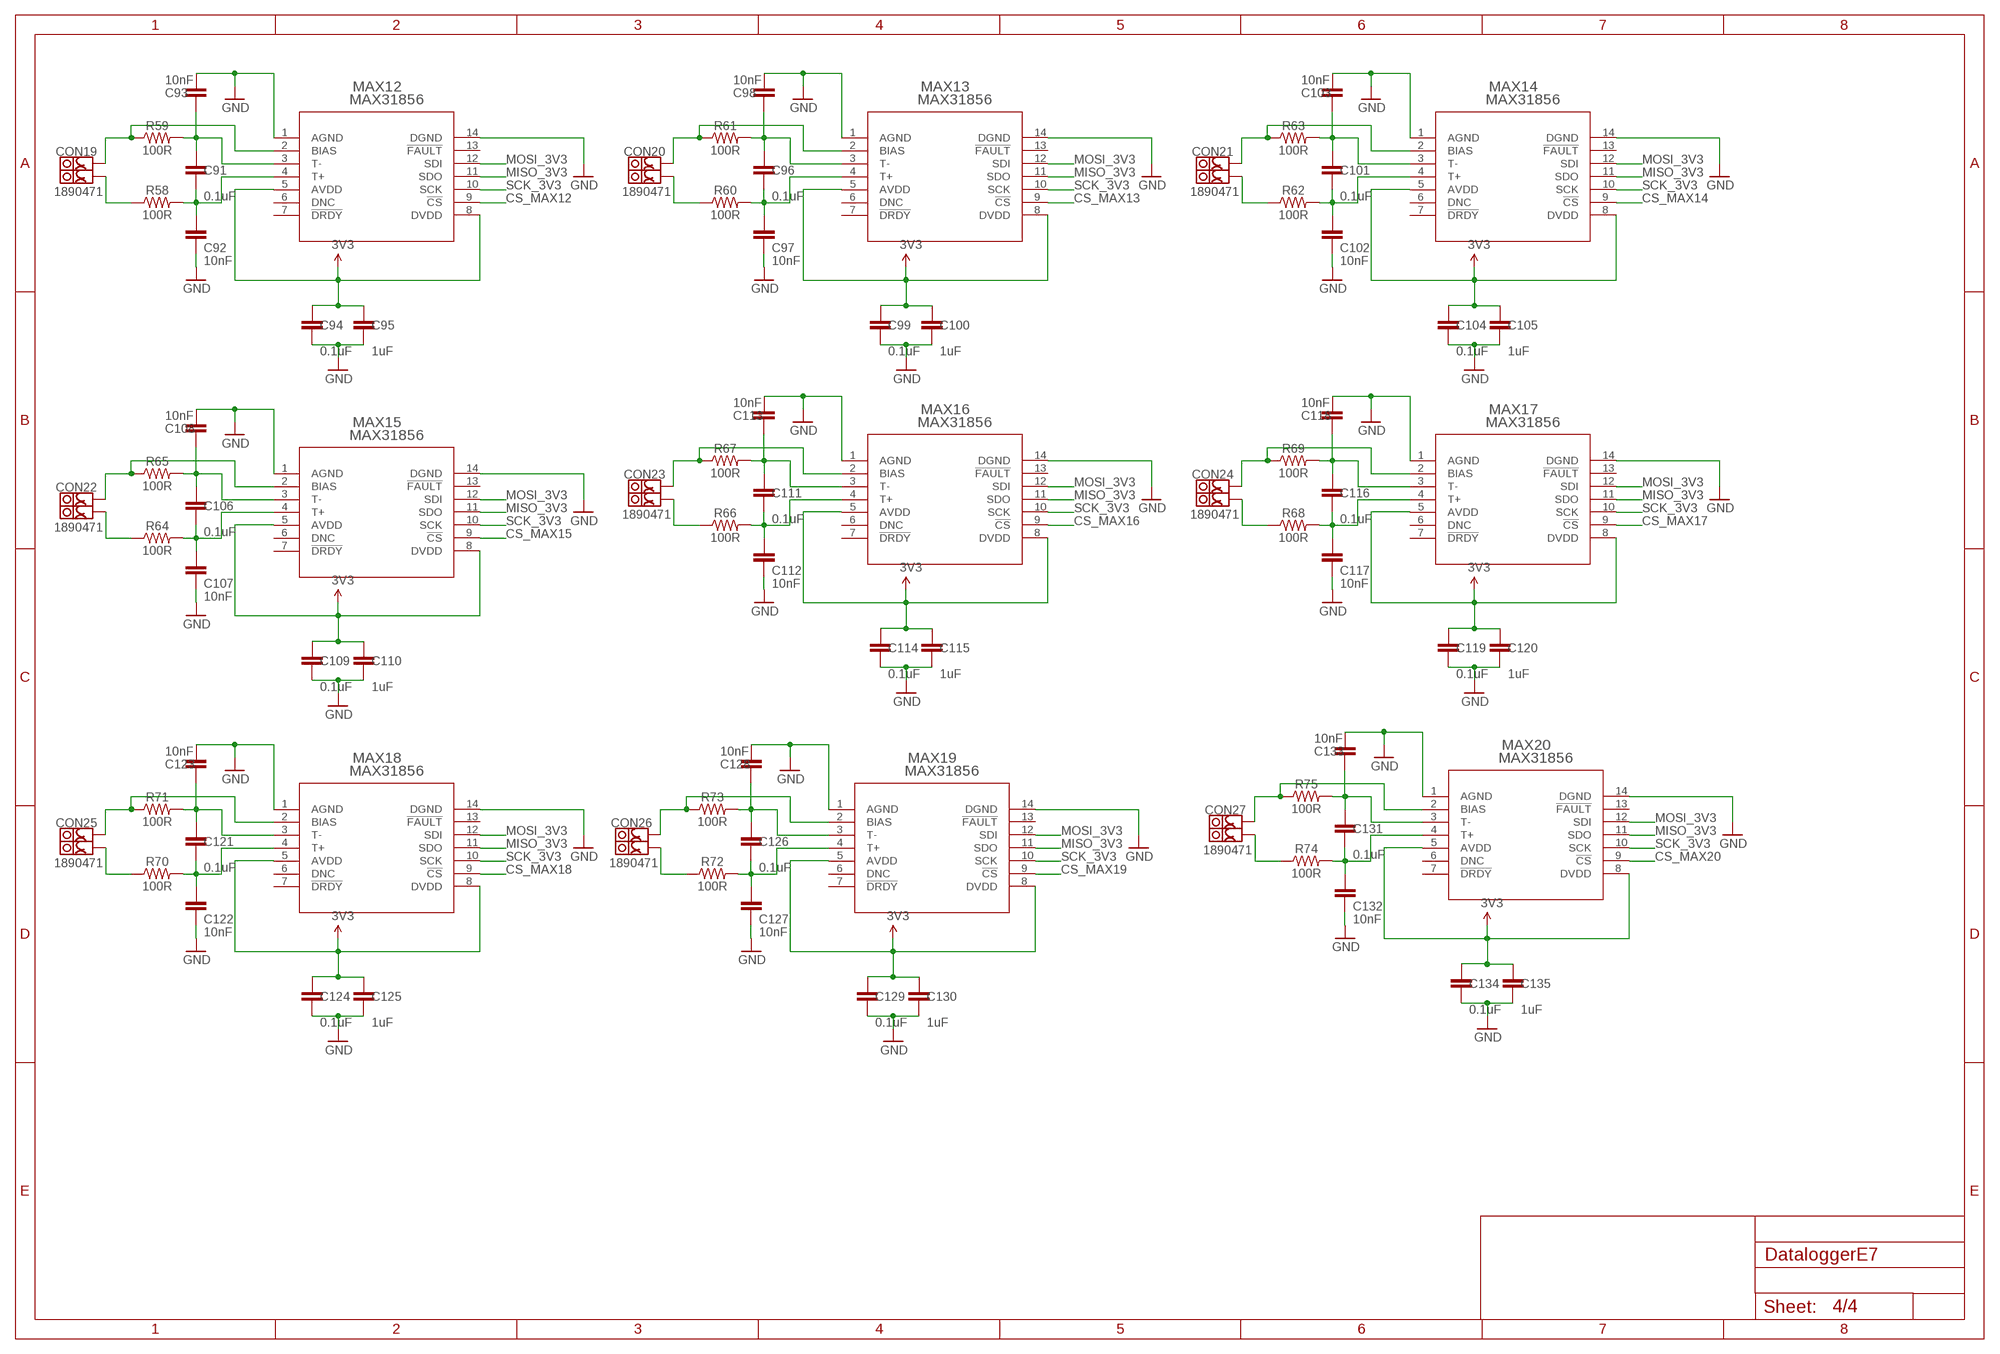
[diagram p3: schematic, sheet 4]

### Parts
C91  0.1uF  C0603_0.1UF  [0603]
C92  10nF  C0603_10NF  [0603]
C93  10nF  C0603_10NF  [0603]
C94  0.1uF  C0603_0.1UF  [0603]
C95  1uF  C0603_1UF  [0603]
C96  0.1uF  C0603_0.1UF  [0603]
C97  10nF  C0603_10NF  [0603]
C98  10nF  C0603_10NF  [0603]
C99  0.1uF  C0603_0.1UF  [0603]
C100  1uF  C0603_1UF  [0603]
C101  0.1uF  C0603_0.1UF  [0603]
C102  10nF  C0603_10NF  [0603]
C103  10nF  C0603_10NF  [0603]
C104  0.1uF  C0603_0.1UF  [0603]
C105  1uF  C0603_1UF  [0603]
C106  0.1uF  C0603_0.1UF  [0603]
C107  10nF  C0603_10NF  [0603]
C108  10nF  C0603_10NF  [0603]
C109  0.1uF  C0603_0.1UF  [0603]
C110  1uF  C0603_1UF  [0603]
C111  0.1uF  C0603_0.1UF  [0603]
C112  10nF  C0603_10NF  [0603]
C113  10nF  C0603_10NF  [0603]
C114  0.1uF  C0603_0.1UF  [0603]
C115  1uF  C0603_1UF  [0603]
C116  0.1uF  C0603_0.1UF  [0603]
C117  10nF  C0603_10NF  [0603]
C118  10nF  C0603_10NF  [0603]
C119  0.1uF  C0603_0.1UF  [0603]
C120  1uF  C0603_1UF  [0603]
C121  0.1uF  C0603_0.1UF  [0603]
C122  10nF  C0603_10NF  [0603]
C123  10nF  C0603_10NF  [0603]
C124  0.1uF  C0603_0.1UF  [0603]
C125  1uF  C0603_1UF  [0603]
C126  0.1uF  C0603_0.1UF  [0603]
C127  10nF  C0603_10NF  [0603]
C128  10nF  C0603_10NF  [0603]
C129  0.1uF  C0603_0.1UF  [0603]
C130  1uF  C0603_1UF  [0603]
C131  0.1uF  C0603_0.1UF  [0603]
C132  10nF  C0603_10NF  [0603]
C133  10nF  C0603_10NF  [0603]
C134  0.1uF  C0603_0.1UF  [0603]
C135  1uF  C0603_1UF  [0603]
CON19  1890471  [1890471]
CON20  1890471  [1890471]
CON21  1890471  [1890471]
CON22  1890471  [1890471]
CON23  1890471  [1890471]
CON24  1890471  [1890471]
CON25  1890471  [1890471]
CON26  1890471  [1890471]
CON27  1890471  [1890471]
MAX12  MAX31856  [21-066J-14-M]
MAX13  MAX31856  [21-066J-14-M]
MAX14  MAX31856  [21-066J-14-M]
MAX15  MAX31856  [21-066J-14-M]
MAX16  MAX31856  [21-066J-14-M]
MAX17  MAX31856  [21-066J-14-M]
MAX18  MAX31856  [21-066J-14-M]
MAX19  MAX31856  [21-066J-14-M]
MAX20  MAX31856  [21-066J-14-M]
R58  100R  R0603_100R  [0603]
R59  100R  R0603_100R  [0603]
R60  100R  R0603_100R  [0603]
R61  100R  R0603_100R  [0603]
R62  100R  R0603_100R  [0603]
R63  100R  R0603_100R  [0603]
R64  100R  R0603_100R  [0603]
R65  100R  R0603_100R  [0603]
R66  100R  R0603_100R  [0603]
R67  100R  R0603_100R  [0603]
R68  100R  R0603_100R  [0603]
R69  100R  R0603_100R  [0603]
R70  100R  R0603_100R  [0603]
R71  100R  R0603_100R  [0603]
R72  100R  R0603_100R  [0603]
R73  100R  R0603_100R  [0603]
R74  100R  R0603_100R  [0603]
R75  100R  R0603_100R  [0603]

### Nets
3V3: C94.1 C95.1 C99.1 C100.1 C104.1 C105.1 C109.1 C110.1 C114.1 C115.1 C119.1 C120.1 C124.1 C125.1 C129.1 C130.1 C134.1 C135.1 MAX12.5(AVDD) MAX12.8(DVDD) MAX13.5(AVDD) MAX13.8(DVDD) MAX14.5(AVDD) MAX14.8(DVDD) MAX15.5(AVDD) MAX15.8(DVDD) MAX16.5(AVDD) MAX16.8(DVDD) MAX17.5(AVDD) MAX17.8(DVDD) MAX18.5(AVDD) MAX18.8(DVDD) MAX19.5(AVDD) MAX19.8(DVDD) MAX20.5(AVDD) MAX20.8(DVDD) ; also sheet 1,2,3
BIAS4: CON19.A(1A) CON19.B(1A) MAX12.2(BIAS) R59.1
BIAS12: CON20.A(1A) CON20.B(1A) MAX13.2(BIAS) R61.1
BIAS13: CON21.A(1A) CON21.B(1A) MAX14.2(BIAS) R63.1
BIAS14: CON22.A(1A) CON22.B(1A) MAX15.2(BIAS) R65.1
BIAS15: CON23.A(1A) CON23.B(1A) MAX16.2(BIAS) R67.1
BIAS16: CON24.A(1A) CON24.B(1A) MAX17.2(BIAS) R69.1
BIAS17: CON25.A(1A) CON25.B(1A) MAX18.2(BIAS) R71.1
BIAS18: CON26.A(1A) CON26.B(1A) MAX19.2(BIAS) R73.1
BIAS19: CON27.A(1A) CON27.B(1A) MAX20.2(BIAS) R75.1
CS_MAX12: MAX12.9(!CS) ; also sheet 2
CS_MAX13: MAX13.9(!CS) ; also sheet 2
CS_MAX14: MAX14.9(!CS) ; also sheet 2
CS_MAX15: MAX15.9(!CS) ; also sheet 2
CS_MAX16: MAX16.9(!CS) ; also sheet 2
CS_MAX17: MAX17.9(!CS) ; also sheet 2
CS_MAX18: MAX18.9(!CS) ; also sheet 2
CS_MAX19: MAX19.9(!CS) ; also sheet 2
CS_MAX20: MAX20.9(!CS) ; also sheet 2
GND: C92.2 C93.1 C94.2 C95.2 C97.2 C98.1 C99.2 C100.2 C102.2 C103.1 C104.2 C105.2 C107.2 C108.1 C109.2 C110.2 C112.2 C113.1 C114.2 C115.2 C117.2 C118.1 C119.2 C120.2 C122.2 C123.1 C124.2 C125.2 C127.2 C128.1 C129.2 C130.2 C132.2 C133.1 C134.2 C135.2 MAX12.1(AGND) MAX12.14(DGND) MAX13.1(AGND) MAX13.14(DGND) MAX14.1(AGND) MAX14.14(DGND) MAX15.1(AGND) MAX15.14(DGND) MAX16.1(AGND) MAX16.14(DGND) MAX17.1(AGND) MAX17.14(DGND) MAX18.1(AGND) MAX18.14(DGND) MAX19.1(AGND) MAX19.14(DGND) MAX20.1(AGND) MAX20.14(DGND) ; also sheet 1,2,3
MISO_3V3: MAX12.11(SDO) MAX13.11(SDO) MAX14.11(SDO) MAX15.11(SDO) MAX16.11(SDO) MAX17.11(SDO) MAX18.11(SDO) MAX19.11(SDO) MAX20.11(SDO) ; also sheet 2,3
MOSI_3V3: MAX12.12(SDI) MAX13.12(SDI) MAX14.12(SDI) MAX15.12(SDI) MAX16.12(SDI) MAX17.12(SDI) MAX18.12(SDI) MAX19.12(SDI) MAX20.12(SDI) ; also sheet 2,3
N$2: CON20.A1(1A1) CON20.B1(1A1) R60.1
N$5: CON21.A1(1A1) CON21.B1(1A1) R62.1
N$7: CON19.A1(1A1) CON19.B1(1A1) R58.1
N$10: CON22.A1(1A1) CON22.B1(1A1) R64.1
N$16: CON23.A1(1A1) CON23.B1(1A1) R66.1
N$42: CON24.A1(1A1) CON24.B1(1A1) R68.1
N$43: CON25.A1(1A1) CON25.B1(1A1) R70.1
N$44: CON26.A1(1A1) CON26.B1(1A1) R72.1
N$45: CON27.A1(1A1) CON27.B1(1A1) R74.1
SCK_3V3: MAX12.10(SCK) MAX13.10(SCK) MAX14.10(SCK) MAX15.10(SCK) MAX16.10(SCK) MAX17.10(SCK) MAX18.10(SCK) MAX19.10(SCK) MAX20.10(SCK) ; also sheet 2,3
T+4: C91.2 C92.1 MAX12.4(T+) R58.2
T+12: C96.2 C97.1 MAX13.4(T+) R60.2
T+13: C101.2 C102.1 MAX14.4(T+) R62.2
T+14: C106.2 C107.1 MAX15.4(T+) R64.2
T+15: C111.2 C112.1 MAX16.4(T+) R66.2
T+16: C116.2 C117.1 MAX17.4(T+) R68.2
T+17: C121.2 C122.1 MAX18.4(T+) R70.2
T+18: C126.2 C127.1 MAX19.4(T+) R72.2
T+19: C131.2 C132.1 MAX20.4(T+) R74.2
T-4: C91.1 C93.2 MAX12.3(T-) R59.2
T-12: C96.1 C98.2 MAX13.3(T-) R61.2
T-13: C101.1 C103.2 MAX14.3(T-) R63.2
T-14: C106.1 C108.2 MAX15.3(T-) R65.2
T-15: C111.1 C113.2 MAX16.3(T-) R67.2
T-16: C116.1 C118.2 MAX17.3(T-) R69.2
T-17: C121.1 C123.2 MAX18.3(T-) R71.2
T-18: C126.1 C128.2 MAX19.3(T-) R73.2
T-19: C131.1 C133.2 MAX20.3(T-) R75.2
Unconnected: MAX12.6(DNC) MAX12.7(!DRDY) MAX12.13(!FAULT) MAX13.6(DNC) MAX13.7(!DRDY) MAX13.13(!FAULT) MAX14.6(DNC) MAX14.7(!DRDY) MAX14.13(!FAULT) MAX15.6(DNC) MAX15.7(!DRDY) MAX15.13(!FAULT) MAX16.6(DNC) MAX16.7(!DRDY) MAX16.13(!FAULT) MAX17.6(DNC) MAX17.7(!DRDY) MAX17.13(!FAULT) MAX18.6(DNC) MAX18.7(!DRDY) MAX18.13(!FAULT) MAX19.6(DNC) MAX19.7(!DRDY) MAX19.13(!FAULT) MAX20.6(DNC) MAX20.7(!DRDY) MAX20.13(!FAULT)

## Library data of the parts
B1 = rectifier:DB?*G: Single Phase 1.0 AMP Glass Passivated Bridge Rectifier Taiwan Semiconductor Co.,Ltd. - TSC Source: http://www.taiwansemi.com/TSCbig5/ezcatfiles/cust/img/img/db101g.pdf http://www.ts.com.tw/db/pictures/modules/PDT/PDT060207001/DBLS201G.pdf
B_BACK B_DOWN B_LEFT B_OK B_RESET B_RIGHT B_UP = Librairie Anthony:222AMVBAR: Tactile switch; MPN: 222AMVBAR; N_MOUSER: 774-222AMVBAR
BAT1 = DavidThales:S8421-45R-CR2032
C1-C4 C7 C8 C11 C17 C20-C26 C28-C35 C38 C42 C44-C46 C49 C51 C54 C56 C59 C61 C64 C66 C69 C71 C74 C76 C79 C81 C84 C86 C89 C91 C94 C96 C99 C101 C104 C106 C109 C111 C114 C116 C119 C121 C124 C126 C129 C131 C134 C139 C140 C146-C149 C151 = AAAnthony:C0603_0.1UF
C5 C6 C9 C10 C12 C15 C16 C47 C48 C52 C53 C57 C58 C62 C63 C67 C68 C72 C73 C77 C78 C82 C83 C87 C88 C92 C93 C97 C98 C102 C103 C107 C108 C112 C113 C117 C118 C122 C123 C127 C128 C132 C133 C136 C137 C141-C144 = AAAnthony:C0603_10NF
C13 C18 C19 C40 C41 C50 C55 C60 C65 C70 C75 C80 C85 C90 C95 C100 C105 C110 C115 C120 C125 C130 C135 C145 C150 = AAAnthony:C0603_1UF
C14 C27 C36 C37 = AAAnthony:C1206_10UF
C39 C43 C138 = AAAnthony:C1206_47UF
CON1 CON9-CON27 = Librairie Anthony:1890471: PhoenixCcontact 2 pos connector
CON2-CON5 CON8 CON28-CON31 CON33-CON35 = Librairie Anthony:CON_PHOENIX_508_2
CON6 = Aymeric_Thales:RAPC722X: Jack connector | positive center
CON7 = Aymeric_Thales:MOLEX_5033981892: SD card connector
D1 = Librairie Anthony:DIODE-ZENER: Zener Diode A Zener diode allows current to flow from its anode to its cathode like a normal semiconductor diode, but it also permits current to flow in the reverse direction when its "Zener voltage" is reached. - WIkipedia; MPN: CMDZ15L TR; N_MOUSER: 610-CMDZ15L; PROD_ID: DIO-12442
D2 D3 = diode:BAT54S: Schottky Diodes Pin connection corrected 2011-05-04 Source: Fairchild .. BAT54.pdf
F1 F2 = Aymeric_Thales:0ZCJ0005FF2E: Polyfuse | 10A/60V | 50mA hold/150mA trip
IC1 = atmel-2005:ATMEGA*: MICROCONTROLLER 64/128/256 Kbytes FLASH 4 Kbytes EEPROM 8 Kbytes SRAM 86 General Purpose I/O pins 12-channels16-bit PWM 4 x Serial USARTs 16-channels 10-bit A/D
IC2 = AAAnthony:ADG732
IC3 = AAAnthony:74AHCT1G126
INA1 INA2 = FaBo-Mems:TI-INA226: Texus Instruments INA226(Power)
JP1 = atmel-1:AVR-ISP-6: AVR ISP-6 Serial Programming Header
JP2 JP3 = pinhead:PINHD-1X3: PIN HEADER
JP4 JP5 = pinhead:PINHD-1X2: PIN HEADER
JP6 JP7 = pinhead:PINHD-1X4: PIN HEADER
JTAG1 = AAAnthony:AVR_DEBUG
LCD1 = Aymeric_Thales:NHD-0420H1Z-FSW-GBW: LCD 20x4ch_2x8pins
LED1-LED3 LED_SD VREF_ON = adafruit:LED: LED OSRAM: - CHIPLED LG R971, LG N971, LY N971, LG Q971, LY Q971, LO R971, LY R971 LH N974, LH R974 LS Q976, LO Q976, LY Q976 LO Q996 - Hyper CHIPLED LW Q18S LB Q993, LB Q99A, LB R99A - SideLED LS A670, LO A670, LY A670, LG A670, LP A670 LB A673, LV A673, LT A673, LW A673 LH A674 LY A675 LS A676, LA A676, LO A676, LY A676, LW A676 LS A679, LY A679, LG A679 - Hyper Micro SIDELED® LS Y876, LA Y876, LO Y876, LY Y876 LT Y87S - SmartLED LW L88C, LW L88S LB L89C, LB L89S, LG L890 LS L89K, LO L89K, LY L89K LS L896, LA L896, LO L896, LY L896 - TOPLED LS T670, LO T670, LY T670, LG T670, LP T670 LSG T670, LSP T670, LSY T670, LOP T670, LYG T670 LG T671, LOG T671, LSG T671 LB T673, LV T673, LT T673, LW T673 LH T674 LS T676, LA T676, LO T676, LY T676, LB T676, LH T676, LSB T676, LW T676 LB T67C, LV T67C, LT T67C, LS T67K, LO T67K, LY T67K, LW E67C LS E67B, LA E67B, LO E67B, LY E67B, LB E67C, LV E67C, LT E67C LW T67C LS T679, LY T679, LG T679 LS T770, LO T770, LY T770, LG T770, LP T770 LB T773, LV T773, LT T773, LW T773 LH T774 LS E675, LA E675, LY E675, LS T675 LS T776, LA T776, LO T776, LY T776, LB T776 LHGB T686 LT T68C, LB T68C - Hyper Mini TOPLED® LB M676 - Mini TOPLED Santana® LG M470 LS M47K, LO M47K, LY M47K Source: http://www.osram.convergy.de/
MAX1-MAX20 = Librairie Anthony:MAX31856; MPN: MAX31856MUD+; N_MOUSER: 700-MAX31856MUD+
POT1 = Aymeric_Thales:3361P-1-103GLF: Trimmer SMD 10k
R1 R7 = AAAnthony:R0603_39K
R2 R3 R6 R8 R9 R12-R23 R30 R36-R43 R84 R86 R88 R90-R93 = AAAnthony:R0603_10K
R4 R5 R10 R11 R25 R26 R29 R32 R33 R44-R75 R83 R85 R87 R89 = AAAnthony:R0603_100R
R24 = AAAnthony:R1206_470R
R27 R28 R31 R76 = AAAnthony:R0603_1K5
R34 R95 = AAAnthony:R2010_PRE: Rshunt
R35 = AAAnthony:R0603_1M
RTC1 = Aymeric_Thales:DS3231M: RTC
SERIAL = con-lstb:MA04-1: PIN HEADER; OC_FARNELL: unknown; OC_NEWARK: unknown
TVS1 = Aymeric_Thales:GSOT24C: TVS 24V
U1 = Librairie Anthony:74LVC2244A: 74LVC2244A; MPN: SN74LVC2244ADWR; N_MOUSER: 595-SN74LVC2244ADWR
U2 U3 U5 = Librairie Anthony:74LVC2G17
VR2 = Librairie Anthony:LM78M05; MPN: LM78M05CDTX/NOPB; N_MOUSER: 926-LM78M05CDTX/NOPB
VR3 = Librairie Anthony:LD1117: LDO 1.1V dropout fixed output; MPN: LD1117S33CTR; N_MOUSER: 511-LD1117S33C
VR4 = Librairie Anthony:LT1461: LT1461 5V REGULATOR 50mA | SO-8
Y1 = Aymeric_Thales:CSTCE16M0V53-R0: Resonator 16MHz

## Net classes
2 gnd: width 0.305 mm, drill 0.406 mm, clearance 0.203 mm